# Altium schematic sheet Battery.SchDoc
size A; SheetNumber: 2; SheetTotal: 2
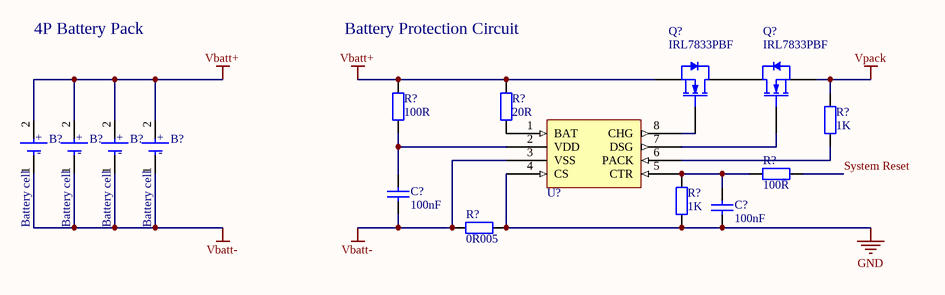
[diagram p0: Battery.SchDoc]

## Parts
(Parts that share a designator on the sheet are numbered #1, #2 ... from top to bottom, then left to right.)
B?#1  Battery cell  [Single battery cell holder]
B?#2  Battery cell  [Single battery cell holder]
B?#3  Battery cell  [Single battery cell holder]
B?#4  Battery cell  [Single battery cell holder]
C?#1  100nF  [Model Name]
C?#2  100nF  [Model Name]
Q?#1  Manufacturer Part Number: IRL7833PBF  [TO-220]  (hidden comment: IRL7833)
Q?#2  Manufacturer Part Number: IRL7833PBF  [TO-220]  (hidden comment: IRL7833)
R?#1  100R
R?#2  20R
R?#3  1K
R?#4  100R
R?#5  1K
R?#6  0R005
U?  BQ2980  (value not drawn)

## Nets
GND: C?#2.1 R?#5.1 R?#6.2 U?.4(CS)
Vbatt+: B?#1.2(A) B?#2.2(A) B?#3.2(A) B?#4.2(A) Q?#1.2(S) R?#1.2 R?#2.2
Vbatt-: B?#1.1(C) B?#2.1(C) B?#3.1(C) B?#4.1(C) C?#1.1 R?#6.1 U?.3(VSS)
Vpack: Q?#2.2(S) R?#3.2
System Reset: R?#4.2
NetC?#1_2: C?#1.2 R?#1.1 U?.2(VDD)
NetC?#2_2: C?#2.2 R?#4.1 R?#5.2 U?.5(CTR)
NetQ?#1_1: Q?#1.1(G) U?.8(CHG)
NetQ?#1_3: Q?#1.3(D) Q?#2.3(D)
NetQ?#2_1: Q?#2.1(G) U?.7(DSG)
NetR?#2_1: R?#2.1 U?.1(BAT)
NetR?#3_1: R?#3.1 U?.6(PACK)

## Notes on the sheet
- 4P Battery Pack
- Battery Protection Circuit
- (in symbol Battery cell) +; -

## Library data of the parts
C?#1 C?#2 = 100nF: Capacitor; Voltage: *; Value: 100nF
Q?#1 Q?#2 = IRL7833: Power Field-Effect Transistor, 75A I(D), 30V, 0.0038ohm, 1-Element, N-Channel, Silicon, Metal-oxide Semiconductor FET, TO-220AB; Manufacturer: Infineon; Package Body Material: Plastic; Case Connection: DRAIN; Drain Current-Max (Abs) (ID): 150A; Drain-source On Resistance-Max: 3.8mR; Number of Elements: 1; Operating Mode: ENHANCEMENT MODE; Power Dissipation-Max (Abs): 140W; Pulsed Drain Current-Max (IDM): 600A; Surface Mount: No; Transistor Application: SWITCHING; Avalanche Energy Rating (Eas): 560mJ; Qualification Status: Not Qualified; Supplier: Mouser; Supplier Part Number: 942-IRL7833PBF; RoHS: Yes; Category: MOSFETs; Stock: 1122; Pricing: 1=1.91, 10=1.58, 50=1.58, 100=1.3, 1000=1.29, 10000=1.29 (USD); Pins: 3; Package Shape: Rectangular; Transistor Element Material: SILICON; Max Operating Temperature: 175°C; Polarity/Channel Type: N-CHANNEL; Drain Current-Max (ID): 75A; DS Breakdown Voltage-Min: 30V; FET Technology: METAL-OXIDE SEMICONDUCTOR; JESD-30 Code: R-PSFM-T3; Package Style: FLANGE MOUNTMeter; Terminal Form: Through Hole; Terminal Position: SINGLE; RoHS Compliant: Yes; JEDEC-95 Code: TO-220AB; Reach SVHC Compliant: Yes; ComponentLink1URL: https://datasheet.ciiva.com:443/pdfs/VipMasterIC/IC/IRSD/IRSDS10955/IRSDS10955-1.pdf?src-supplier=IHS+Markit; ComponentLink1Description: https://datasheet.ciiva.com:443/pdfs/VipMasterIC/IC/IRSD/IRSDS10955/IRSDS10955-1.pdf?src-supplier=IHS+Markit; ComponentLink2URL: https://www.alliedelec.com/m/d/e45b9dddda0c62cdfc43ef0f9d1ac330.pdf?src-supplier=Allied+Electronics; ComponentLink2Description: https://www.alliedelec.com/m/d/e45b9dddda0c62cdfc43ef0f9d1ac330.pdf?src-supplier=Allied+Electronics; ComponentLink3URL: http://datasheet.octopart.com/IRL7833PBF-Infineon-datasheet-7823640.pdf?src-supplier=Mouser; ComponentLink3Description: http://datasheet.octopart.com/IRL7833PBF-Infineon-datasheet-7823640.pdf?src-supplier=Mouser; ComponentLink4URL: http://datasheet.octopart.com/IRL7833PBF-Infineon-datasheet-7823640.pdf?src-supplier=Distrelec; ComponentLink4Description: http://datasheet.octopart.com/IRL7833PBF-Infineon-datasheet-7823640.pdf?src-supplier=Distrelec; ComponentLink5URL: http://datasheet.octopart.com/IRL7833PBF-Infineon-datasheet-7823640.pdf?src-supplier=Rs; ComponentLink5Description: http://datasheet.octopart.com/IRL7833PBF-Infineon-datasheet-7823640.pdf?src-supplier=Rs; ComponentLink6URL: http://www.farnell.com/datasheets/107887.pdf?src-supplier=Element14; ComponentLink6Description: http://www.farnell.com/datasheets/107887.pdf?src-supplier=Element14; ComponentLink7URL: http://datasheet.octopart.com/IRL7833PBF-Infineon-datasheet-7823640.pdf?src-supplier=Digikey; ComponentLink7Description: http://datasheet.octopart.com/IRL7833PBF-Infineon-datasheet-7823640.pdf?src-supplier=Digikey; ComponentLink8URL: http://datasheet.octopart.com/IRL7833PBF-Infineon-datasheet-7823640.pdf?src-supplier=Avnet; ComponentLink8Description: http://datasheet.octopart.com/IRL7833PBF-Infineon-datasheet-7823640.pdf?src-supplier=Avnet; ComponentLink9URL: https://datasheet.octopart.com/IRL7833PBF-Infineon-datasheet-7823640.pdf?src-supplier=Farnell; ComponentLink9Description: https://datasheet.octopart.com/IRL7833PBF-Infineon-datasheet-7823640.pdf?src-supplier=Farnell; ComponentLink10URL: http://datasheet.octopart.com/IRL7833PBF-Infineon-datasheet-7823640.pdf?src-supplier=Future+Electronics; ComponentLink10Description: http://datasheet.octopart.com/IRL7833PBF-Infineon-datasheet-7823640.pdf?src-supplier=Future+Electronics; ComponentLink11URL: https://datasheet.octopart.com/IRL7833PBF-International-Rectifier-datasheet-26461.pdf?src-supplier=Newark; ComponentLink11Description: https://datasheet.octopart.com/IRL7833PBF-International-Rectifier-datasheet-26461.pdf?src-supplier=Newark; ComponentLink12URL: http://datasheet.octopart.com/IRL7833PBF-Infineon-datasheet-7823640.pdf?src-supplier=TME; ComponentLink12Description: http://datasheet.octopart.com/IRL7833PBF-Infineon-datasheet-7823640.pdf?src-supplier=TME; ComponentLink13URL: http://datasheet.octopart.com/IRL7833PBF-Infineon-datasheet-7823640.pdf?src-supplier=NAC+Semi; ComponentLink13Description: http://datasheet.octopart.com/IRL7833PBF-Infineon-datasheet-7823640.pdf?src-supplier=NAC+Semi
R?#1 R?#4 = 100R: Resistor; Value: 100R
R?#2 = 20R: Resistor; Value: 20R
R?#3 R?#5 = 1K: Resistor; Value: 1K
R?#6 = 0R005: 5mOhm resistor; Value: 0R005
U? = BQ2980: Battery Management High-side protector for single-cell li-ion and li-polymer batteries